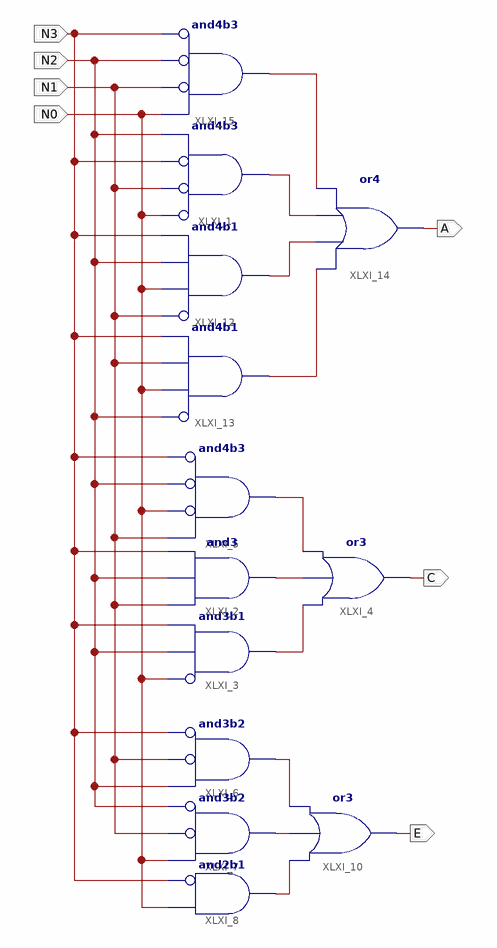
[diagram p0: schematic sheet 1]
// Xilinx ISE schematic COMB_ACE.sch (spartan3e) as structural Verilog: 13 symbols, 7 ports
module COMB_ACE (
  input  N3,
  input  N2,
  input  N1,
  input  N0,
  output A,
  output C,
  output E
);

  wire XLXN_1, XLXN_2, XLXN_3, XLXN_4, XLXN_17, XLXN_22, XLXN_23, XLXN_24, XLXN_25, XLXN_26;

  and XLXI_1 (XLXN_25, ~N0, ~N1, ~N3, N2);  // and4b3
  and XLXI_12 (XLXN_26, ~N1, N0, N2, N3);  // and4b1
  and XLXI_13 (XLXN_4, ~N2, N0, N1, N3);  // and4b1
  or XLXI_14 (A, XLXN_4, XLXN_26, XLXN_25, XLXN_24);
  and XLXI_15 (XLXN_24, ~N3, ~N2, ~N1, N0);  // and4b3
  and XLXI_5 (XLXN_2, ~N3, ~N2, ~N0, N1);  // and4b3
  or XLXI_4 (C, XLXN_3, XLXN_1, XLXN_2);
  and XLXI_3 (XLXN_3, ~N0, N2, N3);  // and3b1
  and XLXI_2 (XLXN_1, N1, N2, N3);
  and XLXI_6 (XLXN_17, ~N3, ~N1, N2);  // and3b2
  and XLXI_7 (XLXN_22, ~N2, ~N1, N0);  // and3b2
  and XLXI_8 (XLXN_23, ~N3, N0);  // and2b1
  or XLXI_10 (E, XLXN_17, XLXN_22, XLXN_23);
endmodule
